# Altium schematic sheet AllinOne1.SchDoc: AC Fan Controler By Bluetooth
size A4; CompanyName: AtoA; DrawnBy: Kasaee,Behboodi; Engineer: Kasaee,Behboodi; Revision: 1.0; SheetNumber: 1; SheetTotal: 1; ProjectName: AC Fan Controler By Bluetooth; Rule: PcbType=ProtelPcb
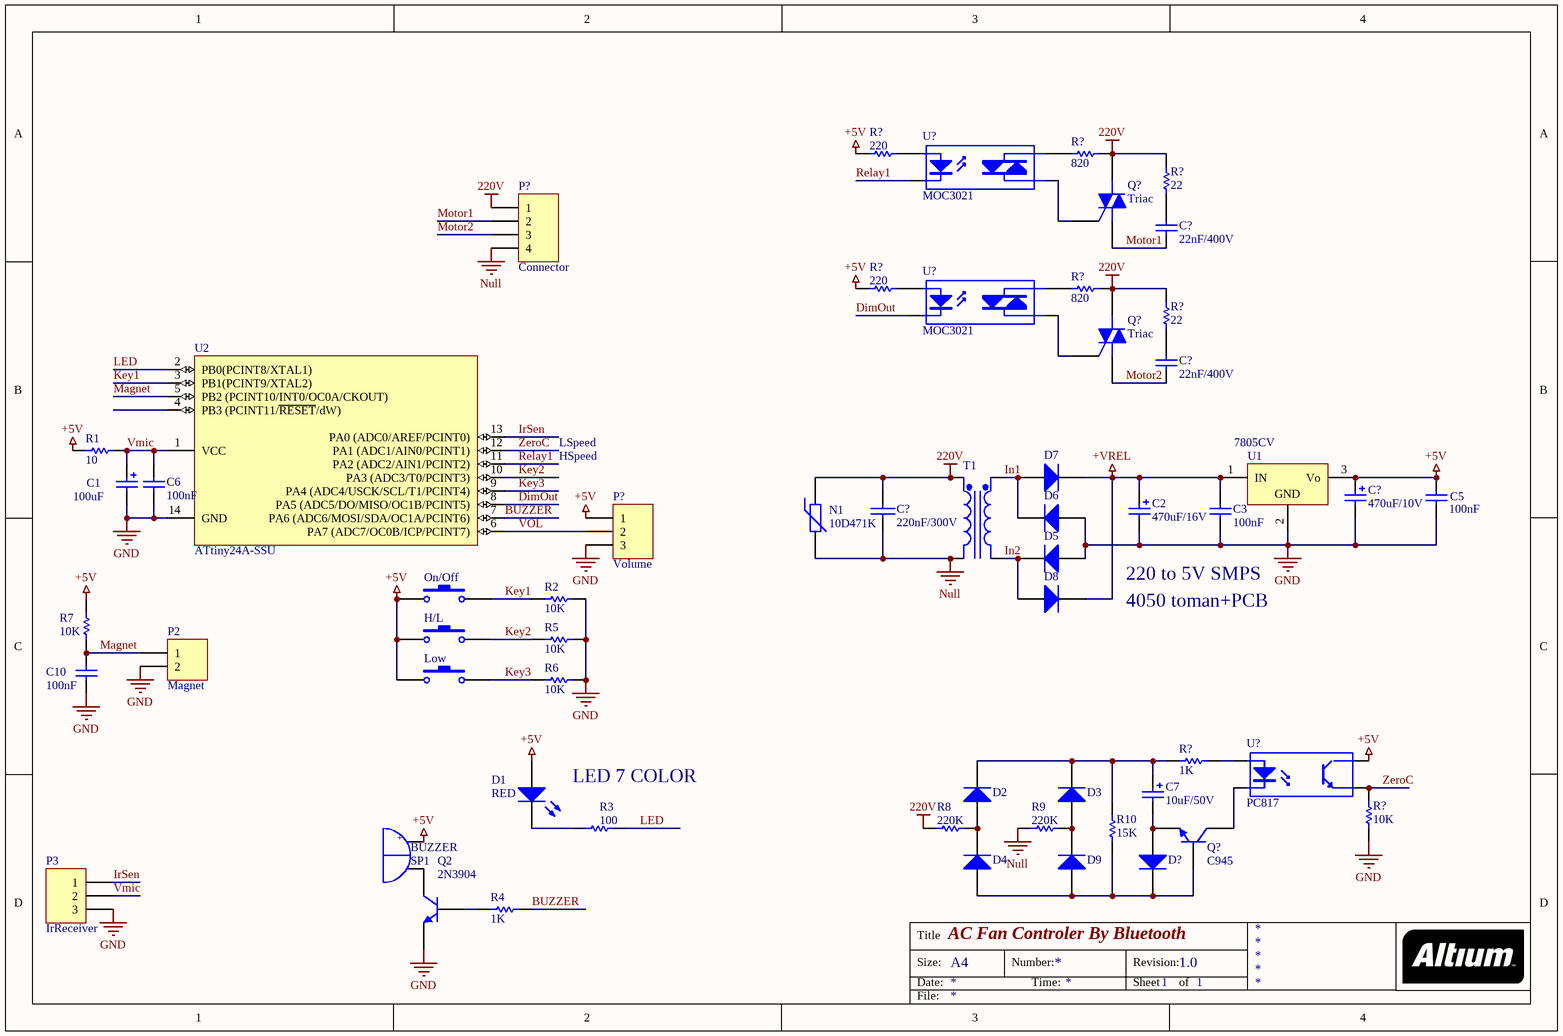
[diagram p0: AllinOne1.SchDoc]

## Parts
(Parts that share a designator on the sheet are numbered #1, #2 ... from top to bottom, then left to right.)
C1  100uF  [RB.15/.2]
C2  470uF/16V  [RB.2/.4]
C3  100nF  [RAD0.2]
C5  100nF  [RAD0.2]
C6  100nF  [RAD0.2]
C7  10uF/50V  [RB.1/.2]
C10  100nF  [RAD0.2]
C?#1  22nF/400V  [RAD0.2]
C?#2  22nF/400V  [RAD0.2]
C?#3  470uF/10V  [RB.2/.4]
C?#4  220nF/300V  [Cap15]
D1  RED  [LED0.5]
D2  1N4007  [DIODE0.4]  (value not drawn)
D3  1N4007  [DIODE0.4]  (value not drawn)
D4  1N4007  [DIODE0.4]  (value not drawn)
D5  1N4007  [DIODE0.4]  (value not drawn)
D6  1N4007  [DIODE0.4]  (value not drawn)
D7  1N4007  [DIODE0.4]  (value not drawn)
D8  1N4007  [DIODE0.4]  (value not drawn)
D9  1N4007  [DIODE0.4]  (value not drawn)
D?  1N4007  [DIODE0.4]  (value not drawn)
N1  10D471K  [varistor-10mil]
P2  Magnet  [Magnet]
P3  IrReceiver  [IrRec1]
P?#1  Connector  [Phoenix4]
P?#2  Volume  [HDR1X3]
Q2  2N3904  [TO92BS1]
Q?#1  Triac  [TO-220HS28]
Q?#2  Triac  [TO-220HS28]
Q?#3  C945  [TO92]
R1  10  [RES0.35]
R2  10K  [RES0.35]
R3  100  [RES0.35]
R4  1K  [RES0.35]
R5  10K  [RES0.35]
R6  10K  [RES0.35]
R7  10K  [RES0.35]
R8  220K  [RES0.35]
R9  220K  [RES0.35]
R10  15K  [RES0.35]
R?#1  220  [RES0.35]
R?#2  820  [RES0.35]
R?#3  22  [RES0.35]
R?#4  220  [RES0.35]
R?#5  820  [RES0.35]
R?#6  22  [RES0.35]
R?#7  1K  [RES0.35]
R?#8  10K  [RES0.35]
S1  On/Off  [PUSHBOT2]
S2  H/L  [PUSHBOT2]
S3  Low  [PUSHBOT2]
SP1  BUZZER  [RB.3/.6]
T1  Transformer  [Trans200mA]  (value not drawn)
U1  7805CV  [TO-220TriacHS]
U2  ATtiny24A-SSU  [SOIC14]
U?#1  MOC3021  [DIP6]
U?#2  MOC3021  [DIP6]
U?#3  PC817  [DIP4-OPTO]

## Nets
220V: C?#4.1 N1.1 P?#1.1 Q?#1.2(M2) Q?#2.2(M2) R8.1 R?#2.1 R?#3.1 R?#5.1 R?#6.1 T1.1(Pri+)
+5V: C5.2 C?#3.1 D1.1(A) P?#2.1 R1.2 R7.2 R?#1.1 R?#4.1 S1.1 S2.1 S3.1 SP1.1 U1.3(Vo) U?#3.4(C)
+VREL: C2.1 C3.2 D7.2(K) D8.2(K) U1.1(IN)
GND: C1.2 C2.2 C3.1 C5.1 C6.1 C10.1 C?#3.2 D5.1(A) D6.1(A) P2.2 P3.3 P?#2.3 Q2.3(E) R2.1 R5.1 R6.1 R?#8.2 U1.2(OUT) U2.14(GND)
Null: C?#4.2 N1.2 P?#1.4 R9.1 T1.2(Pri-)
BUZZER: R4.1 U2.7(PA6_(ADC6/MOSI/SDA/OC1A/PCINT6))
DimOut: U2.8(PA5_(ADC5/DO/MISO/OC1B/PCINT5)) U?#2.2(K)
In1: D6.2(K) D7.1(A) T1.3(Sec+)
In2: D5.2(K) D8.1(A) T1.4(Sec-)
IrSen: P3.1 U2.13(PA0_(ADC0/AREF/PCINT0))
Key1: R2.2 S1.2 U2.3(PB1(PCINT9/XTAL2))
Key2: R5.2 S2.2 U2.10(PA3_(ADC3/T0/PCINT3))
Key3: R6.2 S3.2 U2.9(PA4_(ADC4/USCK/SCL/T1/PCINT4))
LED: R3.1 U2.2(PB0(PCINT8/XTAL1))
Magnet: C10.2 P2.1 R7.1 U2.5(PB2_(PCINT10/INT0/OC0A/CKOUT))
Motor1: C?#1.1 P?#1.2 Q?#1.1(M1)
Motor2: C?#2.1 P?#1.3 Q?#2.1(M1)
Relay1: U2.11(PA2_(ADC2/AIN1/PCINT2)) U?#1.2(K)
Vmic: C1.1 C6.2 P3.2 R1.1 U2.1(VCC)
VOL: P?#2.2 U2.6(PA7_(ADC7/OC0B/ICP/PCINT7))
ZeroC: R?#8.1 U2.12(PA1_(ADC1/AIN0/PCINT1)) U?#3.3(E)
NetC7_1: C7.1 D2.2(K) D3.2(K) R10.2 R?#7.2
NetC7_2: C7.2 D?.1(A) Q?#3.3(E)
NetC?#1_2: C?#1.2 R?#3.2
NetC?#2_2: C?#2.2 R?#6.2
NetD1_2: D1.2(K) R3.2
NetD2_1: D2.1(A) D4.2(K) R8.2
NetD3_1: D3.1(A) D9.2(K) R9.2
NetD4_1: D4.1(A) D9.1(A) D?.2(K) Q?#3.1(B) R10.1
NetQ2_1: Q2.1(B) R4.2
NetQ2_2: Q2.2(C) SP1.2
NetQ?#1_3: Q?#1.3(G) U?#1.4(A/K)
NetQ?#2_3: Q?#2.3(G) U?#2.4(A/K)
NetQ?#3_2: Q?#3.2(C) U?#3.2(K)
NetR?#1_2: R?#1.2 U?#1.1(A)
NetR?#2_2: R?#2.2 U?#1.6(A/K)
NetR?#4_2: R?#4.2 U?#2.1(A)
NetR?#5_2: R?#5.2 U?#2.6(A/K)
NetR?#7_1: R?#7.1 U?#3.1(A)

Not connected (* = marked no-connect by the designer): U2 4(PB3_(PCINT11/~{RESET}/dW))

## Notes on the sheet
- LSpeed
- HSpeed
- 220 to 5V SMPS
- 4050 toman+PCB
- LED 7 COLOR
- Title
- Size:
- Date:
- A4
- Number:
- Time:
- Revision:
- Sheet
- of
- File:
- (in symbol 7805) GND
- (in symbol BUZZER) +

## Library data of the parts
C1 = Cap Pol: Polarized Capacitor; Value: 100pF; Published: 8-Jun-2000; LatestRevisionDate: 17-Jul-2002; LatestRevisionNote: Re-released for DXP Platform.; PackageReference: RB7.6-15; Publisher: Altium Limited
C2 = Cap Pol: Polarized Capacitor; Published: 8-Jun-2000; LatestRevisionDate: 17-Jul-2002; LatestRevisionNote: Re-released for DXP Platform.; PackageReference: RB7.6-15; Publisher: Altium Limited; Value: 470uF/16V
C3 C5 = Cap: Capacitor np; Published: 8-Jun-2000; LatestRevisionDate: 17-Jul-2002; LatestRevisionNote: Re-released for DXP Platform.; PackageReference: RAD-0.3; Publisher: Altium Limited; Value: 100nF
C6 C?#1 C?#2 = Cap: Capacitor; Value: 100pF; Published: 8-Jun-2000; LatestRevisionDate: 17-Jul-2002; LatestRevisionNote: Re-released for DXP Platform.; PackageReference: RAD-0.3; Publisher: Altium Limited
C7 C?#3 = Cap Pol: Polarized Capacitor; Value: 22uF; Published: 8-Jun-2000; LatestRevisionDate: 17-Jul-2002; LatestRevisionNote: Re-released for DXP Platform.; PackageReference: RB7.6-15; Publisher: Altium Limited
C10 = Cap: Capacitor SMD; Value: 100pF; Published: 8-Jun-2000; LatestRevisionDate: 17-Jul-2002; LatestRevisionNote: Re-released for DXP Platform.; PackageReference: RAD-0.3; Publisher: Altium Limited
C?#4 = CAP: Line Cap
D1 = LED0.5: LED Radial 0.5; Published: 8-Jun-2000; LatestRevisionDate: 17-Dec-2003; LatestRevisionNote: PCB Footprint replaced.; DatasheetDocument: 16-Apr-2002; PackageDocument: 16-Apr-2002; PackageReference: 3.5X2.8X1.9; Publisher: Altium Limited
D2-D9 D? = Diode: Published: 8-Jun-2000; LatestRevisionDate: 17-Jul-2002; LatestRevisionNote: Re-released for DXP Platform.; DatasheetDocument: 1998; PackageDocument: Aug-1999; PackageReference: DO-41; Publisher: Altium Limited; Code_JEDEC: DO-204-AL; ComponentLink1Description: Manufacturer Link; ComponentLink1URL: http://www.fairchildsemi.com/; ComponentLink2Description: Datasheet; ComponentLink2URL: http://www.fairchildsemi.com/ds/1N%2F1N4001.pdf
N1 = Res Varistor: Published: 24-Mar-1999; LatestRevisionDate: 04-Mar-2005; LatestRevisionNote: PCB Footprint replaced.; PackageReference: 6-0805; Publisher: Altium Limited
P2 = Header 2: Header, 2-Pin; LatestRevisionDate: 17-Jul-2002; LatestRevisionNote: Re-released for DXP Platform.; Publisher: Altium Limited
P3 = Header 3: 3pin; LatestRevisionDate: 17-Jul-2002; LatestRevisionNote: Re-released for DXP Platform.; Publisher: Altium Limited
P?#1 = Header 4: Header, 4-Pin; LatestRevisionDate: 17-Jul-2002; LatestRevisionNote: Re-released for DXP Platform.; Publisher: Altium Limited
P?#2 = Header 3: Header, 3-Pin; LatestRevisionDate: 17-Jul-2002; LatestRevisionNote: Re-released for DXP Platform.; Publisher: Altium Limited
Q2 Q?#3 = BC337: NPN General Purpose Amplifier; Published: 8-Jun-2000; LatestRevisionDate: 15-Jan-2003; LatestRevisionNote: PCB Footprint 'BCY-W3/D4.7' replaced; DatasheetDocument: 1997; PackageDocument: Sep-1998; PackageReference: TO-92A; Publisher: Altium Limited; Code_JEDEC: TO-92A; ComponentLink1Description: Manufacturer Link; ComponentLink1URL: http://www.fairchildsemi.com/; ComponentLink2Description: Datasheet; ComponentLink2URL: http://www.fairchildsemi.com/ds/2N%2F2N3904.pdf
Q?#1 Q?#2 = Triac: Silicon Bidirectional Triode Thyristor; Note: Pin 2 is electrically connected to Pin 4 (TAB); Published: 29-Sep-2000; LatestRevisionDate: 17-Jul-2002; LatestRevisionNote: Re-released for DXP Platform.; DatasheetDocument: 1999; PackageReference: 369-03; Publisher: Altium Limited; Code_JEDEC: TO-251-AA; ComponentLink1Description: Manufacturer Link; ComponentLink1URL: http://www.motorola.com/
R1-R10 R?#1-R?#8 = Resistor: Published: 8-Jun-2000; LatestRevisionDate: 17-Jul-2002; LatestRevisionNote: Re-released for DXP Platform.; PackageReference: AXIAL-0.5; Publisher: Altium Limited
S1-S3 = SW-PB: 6x6x7; Published: 24-Mar-1999; LatestRevisionDate: 17-Jul-2002; LatestRevisionNote: Re-released for DXP Platform.; PackageReference: SPST-2; Publisher: Altium Limited
SP1 = BUZZER: 5Volt; Text Field1: 40; Text Field2: 20
T1 = Transformer: 6Volt-300mA; Published: 8-Jun-2000; LatestRevisionDate: 17-Jul-2002; LatestRevisionNote: Re-released for DXP Platform.; PackageReference: TRF_4; Publisher: Altium Limited
U1 = 7805: Positive Voltage Regulator; Note: Tab is connected to pin 3 (GND).; Published: 24-Aug-2001; LatestRevisionDate: 17-Jul-2002; LatestRevisionNote: Re-released for DXP Platform.; DatasheetVersion: Dec-1998; PackageVersion: Jun-1998; PackageReference: TO220ABN; Publisher: Altium Limited; PackageDescription: TO, Thru-Hole, Vertical, Heatsink Mounted; 3 In-Line Leads; Pitch 2.54 mm; Pin sequence 1, 3, 2; ComponentLink1Description: Manufacturer Link; ComponentLink1URL: http://www.st.com/
U2 = ATtiny24-16PC: 8-Bit AVR Microcontroller with 2K Bytes of Flash Memory; Published: 17-Sep-2003; LatestRevisionDate: 04-Mar-2005; LatestRevisionNote: Stylized 3D Model Added.; DatasheetVersion: 1477C-AVR-09/02; PackageVersion: Aug-1999; PackageReference: 20P3; Publisher: Altium Limited; PackageDescription: DIP; 20 Leads; Row Spacing 7.62 mm; Pitch 2.54 mm; Code_JEDEC: MS-001-AD; ComponentLink1Description: Manufacturer Link; ComponentLink1URL: http://www.atmel.com; ComponentLink2Description: Datasheet; ComponentLink2URL: http://www.atmel.com/dyn/resources/prod_documents/doc1477.pdf
U?#1 U?#2 = Opto TRIAC_1: Opto-Triac; Published: 24-Mar-1999; LatestRevisionDate: 17-Jul-2002; LatestRevisionNote: Re-released for DXP Platform.; PackageReference: NPSIP4A; Publisher: Altium Limited
U?#3 = Optoisolator1: 4-Pin Phototransistor Optocoupler; Published: 24-Mar-1999; LatestRevisionDate: 04-Mar-2005; LatestRevisionNote: Sch pins 3 & 4 Swapped.; DatasheetDocument: Nov-2003; PackageReference: DIP-4; Publisher: Altium Limited